# Altium schematic sheet SWAP_21DD__LV_DR_BRUSH_REV1_0.SchDoc
size A3
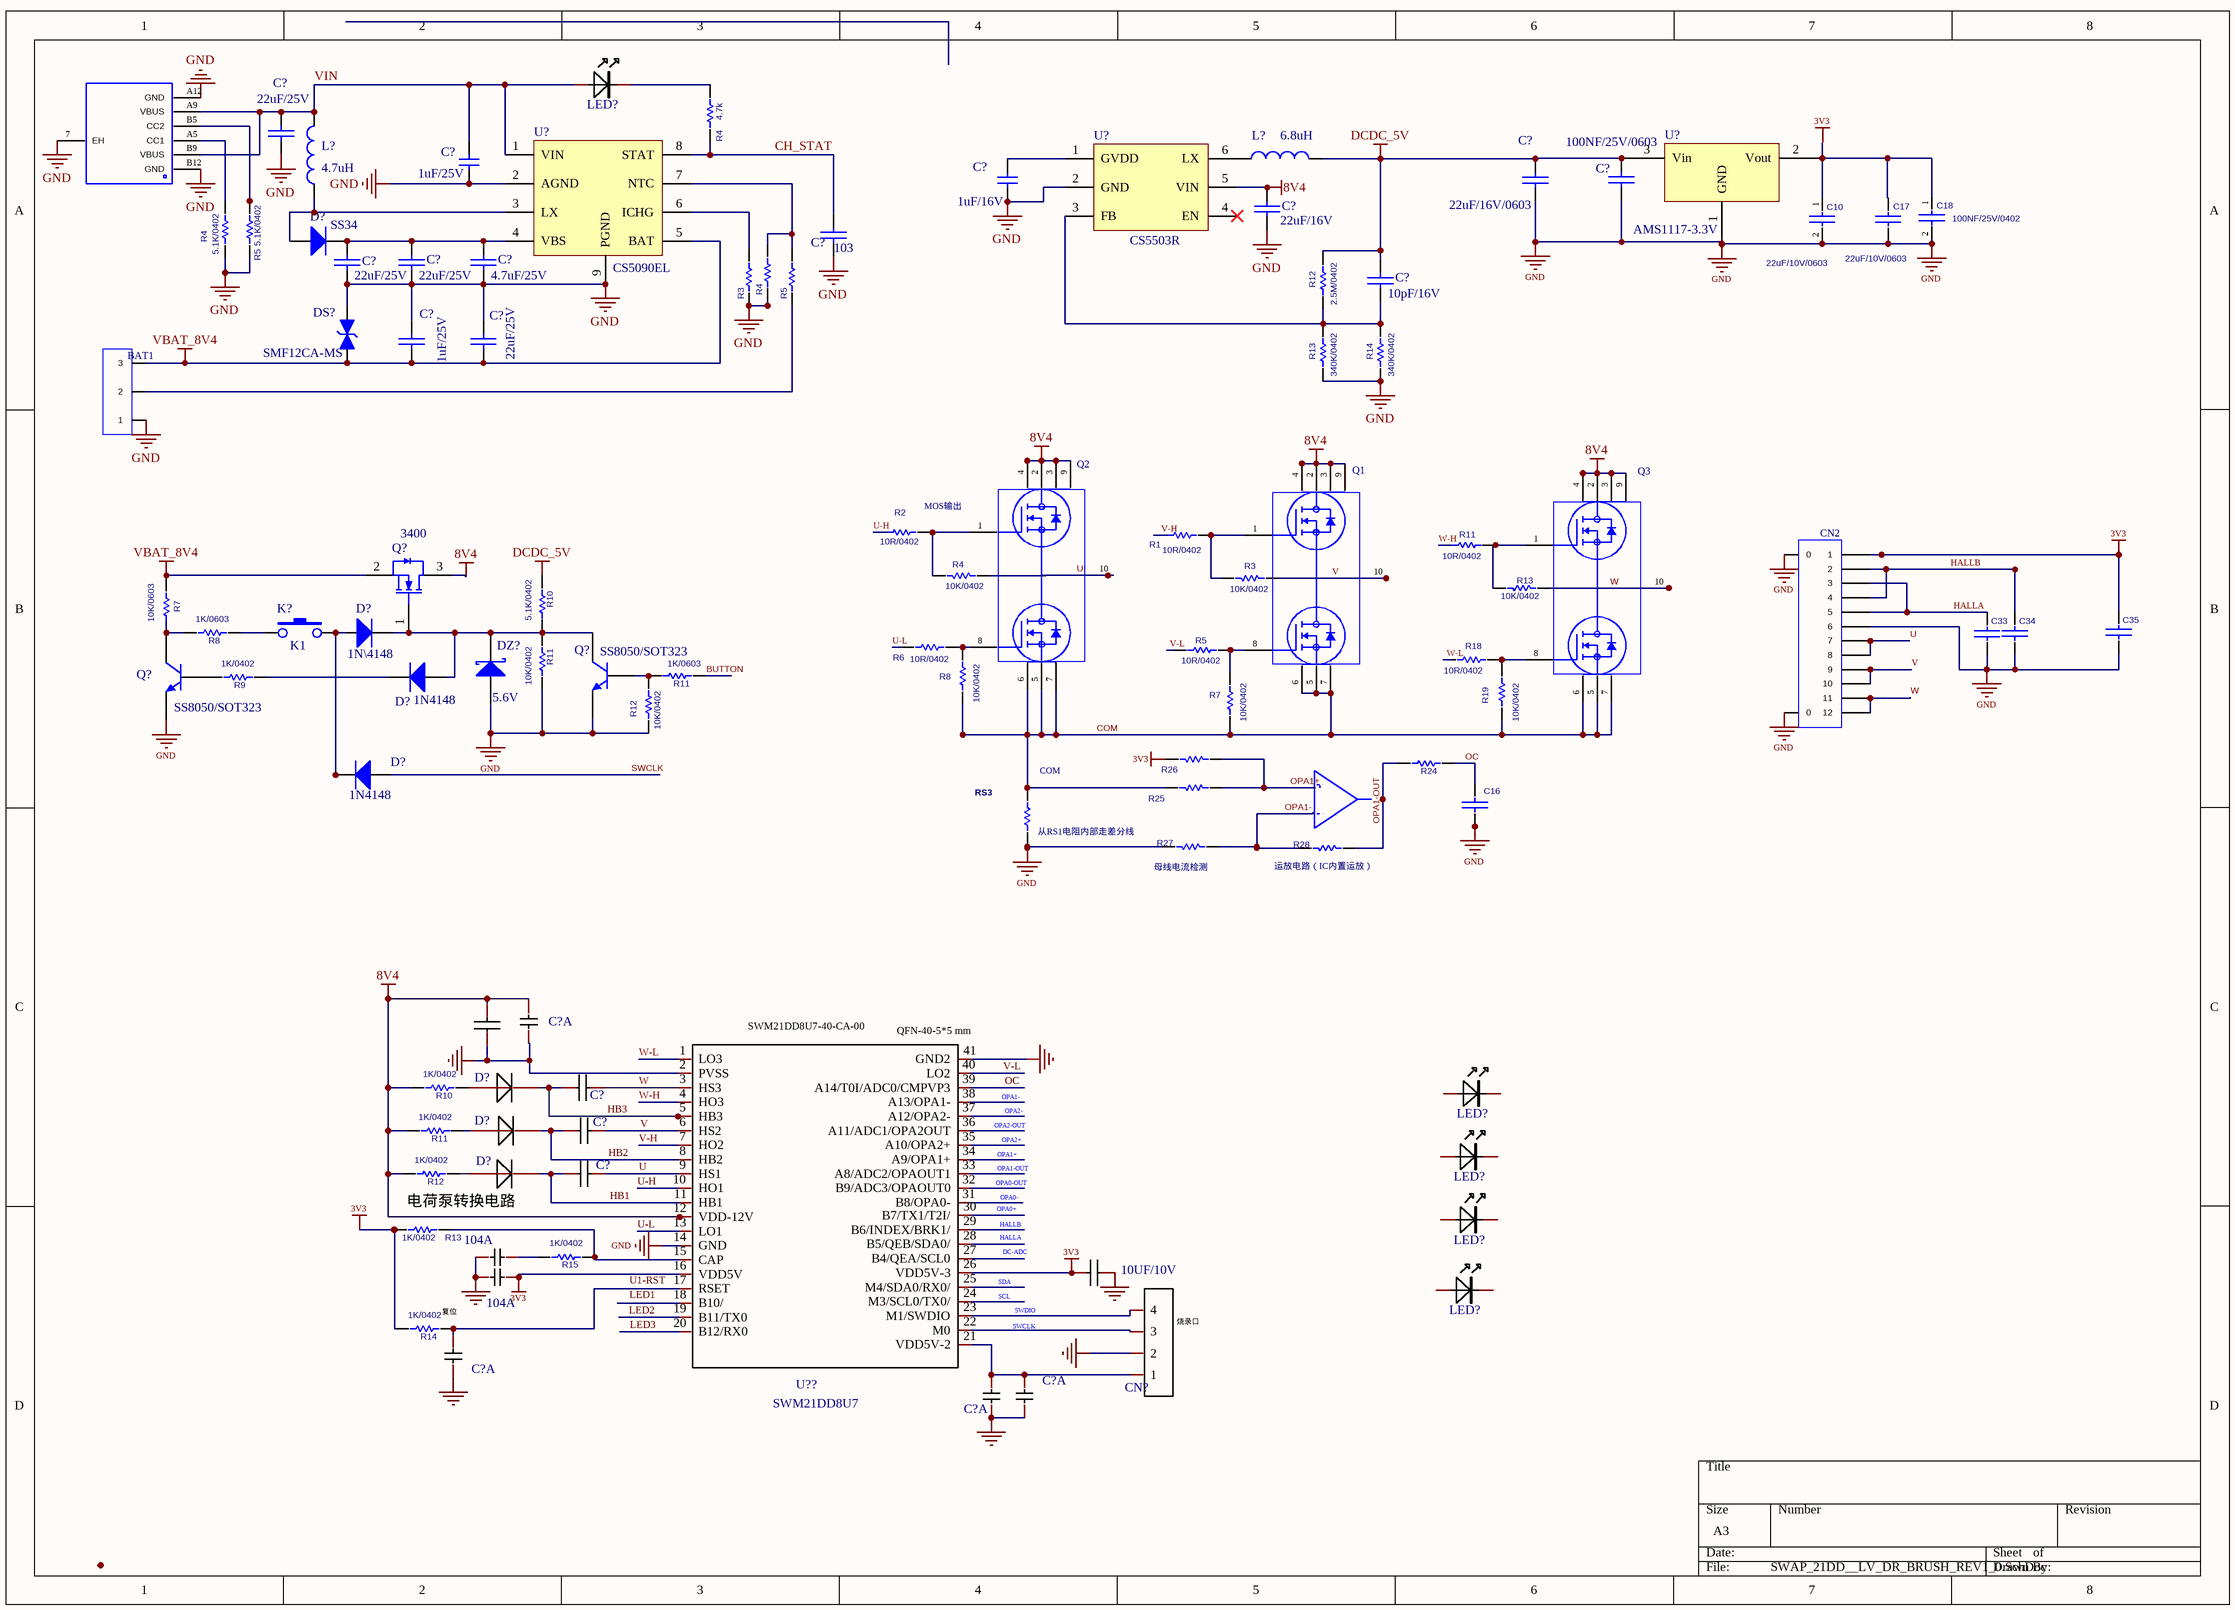
[diagram p0: SWAP_21DD__LV_DR_BRUSH_REV1_0.SchDoc]

## Parts
(Parts that share a designator on the sheet are numbered #1, #2 ... from top to bottom, then left to right.)
104#1  CAP_S  [LC-0402_C]  (value not drawn)  (part A of 2)
104#2  CAP_S  [LC-0402_C]  (value not drawn)  (part A of 2)
BAT1  BAT  [HDR1X3]  (value not drawn)
C10  22uF/10V/0603  [C0603]
C16  CC  [C0402]  (value not drawn)
C17  22uF/10V/0603  [C0603]
C18  100NF/25V/0402  [C0603]
C33  CC  [C0603]  (value not drawn)
C34  CC  [C0603]  (value not drawn)
C35  CC  [C0603]  (value not drawn)
C?#1  22uF/25V  [0805C]
C?#2  1uF/25V  [C 0402_M]
C?#3  100NF/25V/0603  [0805C]
C?#4  22uF/16V/0603  [0805C]
C?#5  1uF/16V  [C 0402_M]
C?#6  22uF/16V  [0805C]
C?#7  103  [R 0402_M]
C?#8  22uF/25V  [0805C]
C?#9  22uF/25V  [0805C]
C?#10  4.7uF/25V  [C 0402_M]
C?#11  10pF/16V  [C 0402_M]
C?#12  22uF/25V  [0805C]
C?#13  1uF/25V  [C 0402_M]
C?#14  CAP_S  [LC-0402_C]  (value not drawn)  (part A of 2)
C?#15  C0805  [LC-0603_C]  (value not drawn)
C?#16  C0805  [LC-0603_C]  (value not drawn)
C?#17  C0805  [LC-0603_C]  (value not drawn)
C?#18  C0805  [LC-0603_C]  (value not drawn)
C?#19  10UF/10V  [LC-0603_C]
C?#20  CAP_S  [LC-0402_C]  (value not drawn)  (part A of 2)
C?#21  CAP_S  [LC-0402_C]  (value not drawn)  (part A of 2)
C?#22  CAP_S  [LC-0402_C]  (value not drawn)  (part A of 2)
CN2  CON12  [SMD-12]  (value not drawn)
CN?  4P-2.54-8  [XH2.54-SMD4P]  (value not drawn)
D?#1  SS34  [SOD123FL]
D?#2  1N\4148  [SOD-323]
D?#3  1N4148  [SOD-323]
D?#4  1N4148  [SOD-323]
D?#5  DIODE  [LC-SOD-323]  (value not drawn)
D?#6  DIODE  [LC-SOD-323]  (value not drawn)
D?#7  DIODE  [LC-SOD-323]  (value not drawn)
DS?  SMF12CA-MS  [SOD-123F]
DZ?  5.6V  [SOT-23_L]
K?  K1  [Button3x4x2]
L?#1  6.8uH  [SMD3X3]
L?#2  4.7uH  [0420-L]
LED?#1  LED  [LED0402]  (value not drawn)
LED?#2  LED  [LED0402]  (value not drawn)
LED?#3  LED  [LED0402]  (value not drawn)
LED?#4  LED  [LED0402]  (value not drawn)
LED?#5  LED  [LED0402]  (value not drawn)
Q1  CJBM3020  [DFN-3X3_8]  (value not drawn)
Q2  CJBM3020  [DFN-3X3_8]  (value not drawn)
Q3  CJBM3020  [DFN-3X3_8]  (value not drawn)
Q?#1  SS8050/SOT323  [NPN]
Q?#2  3400  [MOS_NPN]
Q?#3  SS8050/SOT323  [NPN]
R1  10R/0402  [LC-0402_R]
R2  10R/0402  [LC-0402_R]
R3#1  RES_SEMI  [LC-0402_R]  (value not drawn)
R3#2  10K/0402  [LC-0402_R]
R4#1  4.7k  [LC-0402_R]
R4#2  5.1K/0402  [LC-0402_R]
R4#3  RES_SEMI  [LC-0402_R]  (value not drawn)
R4#4  10K/0402  [LC-0402_R]
R5#1  5.1K/0402  [LC-0402_R]
R5#2  RES_SEMI  [LC-0402_R]  (value not drawn)
R5#3  10R/0402  [LC-0402_R]
R6  10R/0402  [LC-0402_R]
R7#1  10K/0603  [LC-0402_R]
R7#2  10K/0402  [LC-0402_R]
R8#1  1K/0603  [LC-0402_R]
R8#2  10K/0402  [LC-0402_R]
R9  1K/0402  [LC-0402_R]
R10#1  5.1K/0402  [LC-0402_R]
R10#2  1K/0402  [LC-0402_R]
R11#1  10R/0402  [LC-0402_R]
R11#2  10K/0402  [LC-0402_R]
R11#3  1K/0603  [LC-0402_R]
R11#4  1K/0402  [LC-0402_R]
R12#1  2.5M/0402  [LC-0402_R]
R12#2  10K/0402  [LC-0402_R]
R12#3  1K/0402  [LC-0402_R]
R13#1  340K/0402  [LC-0402_R]
R13#2  10K/0402  [LC-0402_R]
R13#3  1K/0402  [LC-0402_R]
R14#1  340K/0402  [LC-0402_R]
R14#2  1K/0402  [LC-0402_R]
R15  1K/0402  [LC-0402_R]
R18  10R/0402  [LC-0402_R]
R19  10K/0402  [LC-0402_R]
R24  RES_SEMI  [LC-0402_R]  (value not drawn)
R25  RES_SEMI  [LC-0402_R]  (value not drawn)
R26  RES_SEMI  [LC-0402_R]  (value not drawn)
R27  RES_SEMI  [LC-0402_R]  (value not drawn)
R28  RES_SEMI  [LC-0402_R]  (value not drawn)
RS3  RES_2512  [LC-0805_R]  (value not drawn)
U?#1  CS5090EL  [DFN2X2_8_0.5]
U?#2  AMS1117-3.3V  [SOT223]
U?#3  CS5503R  [SOT23-6L]
U??  SWM21DD8U7  [QFN40]
USB1  TYPE-C_6P  [TYPE-C-SMD_6P]  (value not drawn)

## Nets
3V3: 104#2.1 C35.1 C?#19.2 CN2.1 R13#3.2 R14#2.2 R26.1 U??.16(VDD5V) U??.26(VDD5V-3)
8V4: C?#6.2 C?#14.2 C?#15.2 Q1.2(D1) Q1.3(D1) Q1.4(D1) Q1.9(D1) Q2.2(D1) Q2.3(D1) Q2.4(D1) Q2.9(D1) Q3.2(D1) Q3.3(D1) Q3.4(D1) Q3.9(D1) Q?#2.3(D) R10#2.2 R11#4.2 R12#3.2 U?#3.5(VIN) U??.12(VDD-12V)
DCDC_5V: C?#3.2 C?#4.2 C?#11.2 L?#1.2 R10#1.1 R12#1.2 U?#2.3(Vin)
GND: 104#1.1 104#2.2 BAT1.1 C10.2 C16.1 C17.2 C18.2 C33.2 C34.2 C35.2 C?#1.1 C?#2.2 C?#3.1 C?#4.1 C?#5.1 C?#6.1 C?#7.1 C?#8.1 C?#9.1 C?#10.1 C?#12.1 C?#13.2 C?#14.1 C?#15.1 C?#19.1 C?#20.2 C?#21.1 C?#22.1 CN2.0 CN2.6 CN?.2 DS?.2(K) DZ?.1(A) Q?#1.1(E) Q?#3.1(E) R3#1.1 R4#2.1 R4#3.1 R5#1.1 R11#2.2 R12#2.2 R13#1.1 R14#1.1 R27.1 RS3.1 U?#1.2(AGND) U?#1.9(PGND) U?#2.1(GND) U?#3.2(GND) U??.2(PVSS) U??.14(GND) U??.41(GND2) USB1.7(EH) USB1.A12(GND) USB1.B12(GND)
VBAT_8V4: BAT1.3 C?#12.2 C?#13.1 DS?.1(A) Q?#2.2(S) R7#1.2 U?#1.5(BAT)
BUTTON: R11#3.1
CH_STAT: C?#7.2 R4#1.1 U?#1.8(STAT)
COM: Q1.5(S2) Q1.6(S2) Q1.7(S2) Q2.5(S2) Q2.6(S2) Q2.7(S2) Q3.5(S2) Q3.6(S2) Q3.7(S2) R7#2.1 R8#2.1 R19.1 R25.1 RS3.2
HALLA: C33.1 CN2.3 CN2.5
HALLB: C34.1 CN2.2 CN2.4 U??.29(B6/INDEX/BRK1/)
HB1: C?#18.1 D?#7.2(K) U??.11(HB1)
HB2: C?#17.1 D?#6.2(K) U??.8(HB2)
HB3: C?#16.1 D?#5.2(K) U??.5(HB3)
LED2: U??.19(B11/TX0)
LED3: U??.20(B12/RX0)
OC: C16.2 R24.2 U??.39(A14/T0I/ADC0/CMPVP3)
OPA0-: U??.31(B8/OPA0-)
OPA0-OUT: U??.32(B9/ADC3/OPAOUT0)
OPA1+: R25.2 R26.2 U??.34(A9/OPA1+)
OPA1-: R27.2 R28.1 U??.38(A13/OPA1-)
OPA1-OUT: R24.1 R28.2 U??.33(A8/ADC2/OPAOUT1)
OPA2+: U??.35(A10/OPA2+)
OPA2-: U??.37(A12/OPA2-)
OPA2-OUT: U??.36(A11/ADC1/OPA2OUT)
SCL: U??.24(M3/SCL0/TX0/)
SDA: U??.25(M4/SDA0/RX0/)
SWCLK: D?#4.1(A)
SWDIO: CN?.4 U??.23(M1/SWDIO)
U: C?#18.2 CN2.7 CN2.8 Q2.10(S1/D2) R4#4.2 U??.9(HS1)
U-H: R2.1 U??.10(HO1)
U-L: R6.1 U??.13(LO1)
V: C?#17.2 CN2.9 CN2.10 Q1.10(S1/D2) R3#2.1 U??.6(HS2)
V-H: R1.1 U??.7(HO2)
V-L: R5#3.1 U??.40(LO2)
VIN: C?#1.2 C?#2.1 L?#2.2 LED?#1.1 U?#1.1(VIN) USB1.A9(VBUS) USB1.B9(VBUS)
W: C?#16.2 CN2.11 CN2.12 Q3.10(S1/D2) R13#2.1 U??.3(HS3)
W-H: R11#1.1 U??.4(HO3)
W-L: R18.1 U??.1(LO3)
Net104#1_2: 104#1.2 R15.2
NetBAT1_2: BAT1.2 R5#2.1
NetC10_1: C10.1 C17.1 C18.1 U?#2.2(Vout)
NetC?#5_2: C?#5.2 U?#3.1(GVDD)
NetC?#8_2: C?#8.2 C?#9.2 C?#10.2 D?#1.2(K) U?#1.4(VBS)
NetC?#11_1: C?#11.1 R12#1.1 R13#1.2 R14#1.2 U?#3.3(FB)
NetC?#20_1: C?#20.1 R14#2.1 U??.17(RSET)
NetC?#21_2: C?#21.2 C?#22.2 CN?.1 U??.21(VDD5V-2)
NetCN?_3: CN?.3 U??.22(M0)
NetD?#1_1: D?#1.1(A) L?#2.1 U?#1.3(LX)
NetD?#2_1: D?#2.1(A) D?#4.2(K) K?.2
NetD?#2_2: D?#2.2(K) D?#3.1(A) DZ?.3(K) Q?#2.1(G) Q?#3.3(C) R10#1.2 R11#2.1
NetD?#3_2: D?#3.2(K) R9.1
NetD?#5_1: D?#5.1(A) R10#2.1
NetD?#6_1: D?#6.1(A) R11#4.1
NetD?#7_1: D?#7.1(A) R12#3.1
NetK?_1: K?.1 R8#1.1
NetL?#1_1: L?#1.1 U?#3.6(LX)
NetLED?#1_2: LED?#1.2 R4#1.2
NetQ1_1: Q1.1(G1) R1.2 R3#2.2
NetQ1_8: Q1.8(G2) R5#3.2 R7#2.2
NetQ2_1: Q2.1(G1) R2.2 R4#4.1
NetQ2_8: Q2.8(G2) R6.2 R8#2.2
NetQ3_1: Q3.1(G1) R11#1.2 R13#2.2
NetQ3_8: Q3.8(G2) R18.2 R19.2
NetQ?#1_2: Q?#1.2(B) R9.2
NetQ?#1_3: Q?#1.3(C) R8#1.2
NetQ?#3_2: Q?#3.2(B) R11#3.2 R12#2.1
NetR3#1_2: R3#1.2 U?#1.6(ICHG)
NetR4#2_2: R4#2.2 USB1.A5(CC1)
NetR4#3_2: R4#3.2 R5#2.2 U?#1.7(NTC)
NetR5#1_2: R5#1.2 USB1.B5(CC2)
NetR13#3_1: R13#3.1 R15.1 U??.15(CAP)

Not connected (* = marked no-connect by the designer): LED?#2 1 2; LED?#3 1 2; LED?#4 1 2; LED?#5 1 2; R7#1 1; U?#3 4(EN)*; U?? 18(B10/) 27(B4/QEA/SCL0) 28(B5/QEB/SDA0/) 30(B7/TX1/T2I/)

## Notes on the sheet
- (near R2) MOS输出
- (near RS3) COM
- (near RS3) 从RS1电阻内部走差分线
- (near R27) 母线电流检测
- (near R28) 运放电路（IC内置运放）
- (near U??) SWM21DD8U7-40-CA-00
- (near U??) QFN-40-5*5 mm
- 电荷泵转换电路
- (near R14#2) 复位
- (near CN?) 烧录口
- Labels drawn without touching a wire or pin: 3V3, DC-ADC, HALLA, LED1, OPA0+, SWCLK, U1-RST

## Library data of the parts
104#1 104#2 C?#14 C?#20-C?#22 = CAP_S: PCB_DECAL: C0603; Add into BOM: yes; Name: CAP_S; Symbol: CAP_S; Device: CAP_S; OldName: CAP_S; Comment_1: CAP_S; PCB DECAL: LC-0402_C; Convert to PCB: yes; Origin Footprint: LC-0402_C
BAT1 = BAT: Connector; PCB DECAL: HDR1X3
C10 C18 C33-C35 = CC: Capacitor; PCB_DECAL: C0603; PCB DECAL: C0603
C16 = CC: 贴片瓷片电容; Value: 100nF; PCB_DECAL: C0603; Published: 8-Jun-2000; LatestRevisionDate: 17-Jul-2002; LatestRevisionNote: Re-released for DXP Platform.; PackageReference: RAD-0.3; Publisher: Altium Limited; Comment_1: C0603; PCB DECAL: C0402
C17 = CC: PCB DECAL: C0603
C?#1 C?#3 C?#4 C?#6-C?#13 = CAP: Capacitor
C?#2 C?#5 = CAP
C?#15-C?#19 = C0805: SMT Resistor 5% UniOhm(厚声); Part_Shape: 0603; Source_Path: E:\GTCS-A01-SWM-P9项目\GTCS-A01-SWM-P9项目V1.2\GTCS-A01-SWM-P9-V1.2.原理图\99.DSN; ValueRank: 33R; ForPin: Pin; Add into BOM: yes; Name: C0805; Symbol: C0805; Device: C0805; OldName: C0805; Published: 8-Jun-2000; LatestRevisionDate: 17-Jul-2002; LatestRevisionNote: Re-released for DXP Platform.; PackageReference: 0805; Publisher: Altium Limited; PackageDescription: Radial Cap, Thru-Hole; 2 Leads; 0.3 in Pin Spacing; PCB_DECAL: C0805; MountType: SMT; Accuracy: 5%; Comment_1: C0805; PCB DECAL: LC-0603_C; Convert to PCB: yes; Origin Footprint: LC-0603_C
CN2 = CON12: Connector; PCB DECAL: SMD-12
CN? = 4P-2.54-8: 接插件  DS-5.1CN4  DS-2.54CWB-4; Add into BOM: yes; Name: 4P-2.54-8; Symbol: 4P-2.54-8; Device: 4P-2.54-8; OldName: 4P-2.54-8; PCB_DECAL: 4P-2.54-8; Comment_1: 4P-2.54-8; PCB DECAL: XH2.54-SMD4P; Convert to PCB: yes; Origin Footprint: XH2.54-SMD4P
D?#1-D?#4 = Diode: Default Diode; Published: 8-Jun-2000; LatestRevisionDate: 17-Jul-2002; LatestRevisionNote: Re-released for DXP Platform.; PackageDocument: Sep-1996; PackageReference: SMC; Publisher: Altium Limited; Code_JEDEC: DO-214-AB
D?#5-D?#7 = DIODE: Default Diode; PCB_DECAL: SOD-123/3; Add into BOM: yes; Name: DIODE; Symbol: DIODE; Device: DIODE; OldName: DIODE; Published: 8-Jun-2000; LatestRevisionDate: 17-Jul-2002; LatestRevisionNote: Re-released for DXP Platform.; PackageVersion: Sep-1996; PackageReference: SMC; Publisher: Altium Limited; PackageDescription: DO-214-AB/SMC; 2 C-Bend Leads; Body 7.9 x 5.9 mm, inc. leads (LxW); Code_JEDEC: DO-214-AB; Comment_1: DIODE; PCB DECAL: LC-SOD-323; Convert to PCB: yes; Origin Footprint: LC-SOD-323
DS? = DIODE-3: 12V/19.9V
DZ? = Diode BAS70: Silicon AF Schottky Diode for High-Speed Switching; Note: Pin 2 is not connected and not drawn.; Published: 21-Mar-2003; LatestRevisionDate: 29-May-2009; LatestRevisionNote: IPC-7351 Footprint Added.; DatasheetVersion: Oct-1999; PackageVersion: Sep-2001; PackageReference: SOT-23; Publisher: Altium Limited; PackageDescription: 3-Pin SOT-23 Package 0.95 mm Pitch, 2.5 mm Lead Span; ComponentLink1Description: Manufacturer Link; ComponentLink1URL: http://www.infineon.com/; ComponentLink2Description: Datasheet; ComponentLink2URL: http://www.infineon.com/upload/Document/cmc_upload/documents/009/382/bas40_bas140series_1.pdf
L?#1 L?#2 = Inductor: Code_IEC: 1005; Published: 8-Jun-2000; LatestRevisionDate: 17-Jul-2002; LatestRevisionNote: Re-released for DXP Platform.; PackageReference: 0402-A; Publisher: Altium Limited; Code_JEITA: 0402
LED?#1-LED?#5 = LED: Add into BOM: yes; Name: LED; Symbol: LED; Device: LED; OldName: LED; PCB DECAL: LED0402; Convert to PCB: yes; Origin Footprint: LED0402
Q?#1 Q?#3 = 2N3904: NPN General Purpose Amplifier; pin to pad: 1>3 2>1 3>2; Published: 8-Jun-2000; LatestRevisionDate: 15-Jan-2003; LatestRevisionNote: PCB Footprint 'BCY-W3/D4.7' replaced; DatasheetVersion: 1997; PackageVersion: Sep-1998; PackageReference: TO-92A; Publisher: Altium Limited; PackageDescription: TO, Flat Index; 3 In-Line, Axial Leads; Body Dia. 4.5mm; Leads 0.51 x 0.48 mm (max); ComponentLink1Description: Manufacturer Link; ComponentLink1URL: http://www.fairchildsemi.com/; ComponentLink2Description: Datasheet; ComponentLink2URL: http://www.fairchildsemi.com/ds/2N%2F2N3904.pdf
Q?#2 = 2N7002 7002: MOS(场效应管); pin to pad: 1>3 2>1 3>2; ComponentLink1Description: 供应商链接; ComponentLink1URL: http://www.szlcsc.com/product/details_9040.html; Package: SOT-23(SOT-23-3); Supplier: LC; SuppliersPartNumber: C8545
R1 R2 R3#1 R3#2 R4#1-R4#4 R5#1-R5#3 R6 R7#1 R7#2 R8#1 R8#2 R9 R10#1 R10#2 R11#1-R11#4 R12#1-R12#3 R13#1-R13#3 R14#1 R14#2 R15 R18 R19 R24-R28 = RES_SEMI: Semiconductor Resistor; Value: 1K; PCB_DECAL: R0603; Published: 8-Jun-2000; LatestRevisionDate: 17-Jul-2002; LatestRevisionNote: Re-released for DXP Platform.; PackageReference: AXIAL-0.5; Publisher: Altium Limited; PackageDescription: Axial Device, Thru-Hole; 2 Leads; 0.5 in Pin Spacing; Comment_1: RES_SEMI; PCB DECAL: LC-0402_R
RS3 = RES_2512: Semiconductor Resistor; Value: 1K; PCB_DECAL: 2512R_6332; Published: 8-Jun-2000; LatestRevisionDate: 17-Jul-2002; LatestRevisionNote: Re-released for DXP Platform.; PackageReference: AXIAL-0.5; Publisher: Altium Limited; PackageDescription: Axial Device, Thru-Hole; 2 Leads; 0.5 in Pin Spacing; Comment_1: RES_2512; PCB DECAL: LC-0805_R
U?#2 = AMS1117: 三端稳压芯片
U?? = SWM21DD8U7: PCB_DECAL: SWM21DK6U7_QFN32_5X5_BA00; Add into BOM: yes; Name: SWM21DD8U7; Symbol: SWM21DD8U7; Device: SWM21DD8U7; OldName: SWM21DD8U7; PCB DECAL: QFN40; Convert to PCB: yes; Origin Footprint: QFN40
USB1 = TYPE-C_6P: Manufacturer: SHOU HAN(首韩); Symbol: TYPE-C 6P(073); Add_into_BOM: yes; Connector_Type: Type-C; Gender: 母; Number_of_Ports: 1; Number_of_Contacts: 6P; Mounting_Style: 卧贴; Current_Rating___Power_(Max): 5A; Operating_Temperature_Range: -25℃~+85℃; Device: TYPE-C 6P(073); Supplier: LCSC; Supplier_Part: C668623; Manufacturer_Part: TYPE-C 6P(073); JLCPCB_Part_Class: Extended Part; LCSC_Part_Name: Type-C 母 卧贴; Supplier_Footprint: SMD; Datasheet: https://atta.szlcsc.com/upload/public/pdf/source/20200618/C668623_A4B260DED7AC1949BAC6AE39E9F4CD80.pdf; Convert_to_PCB: yes; Standard: -; PCB DECAL: TYPE-C-SMD_6P
Q1-Q3 = CJBM3020: PCB DECAL: DFN-3X3_8